# EAGLE design env_sensor_1a (EAGLE 9.7.0)
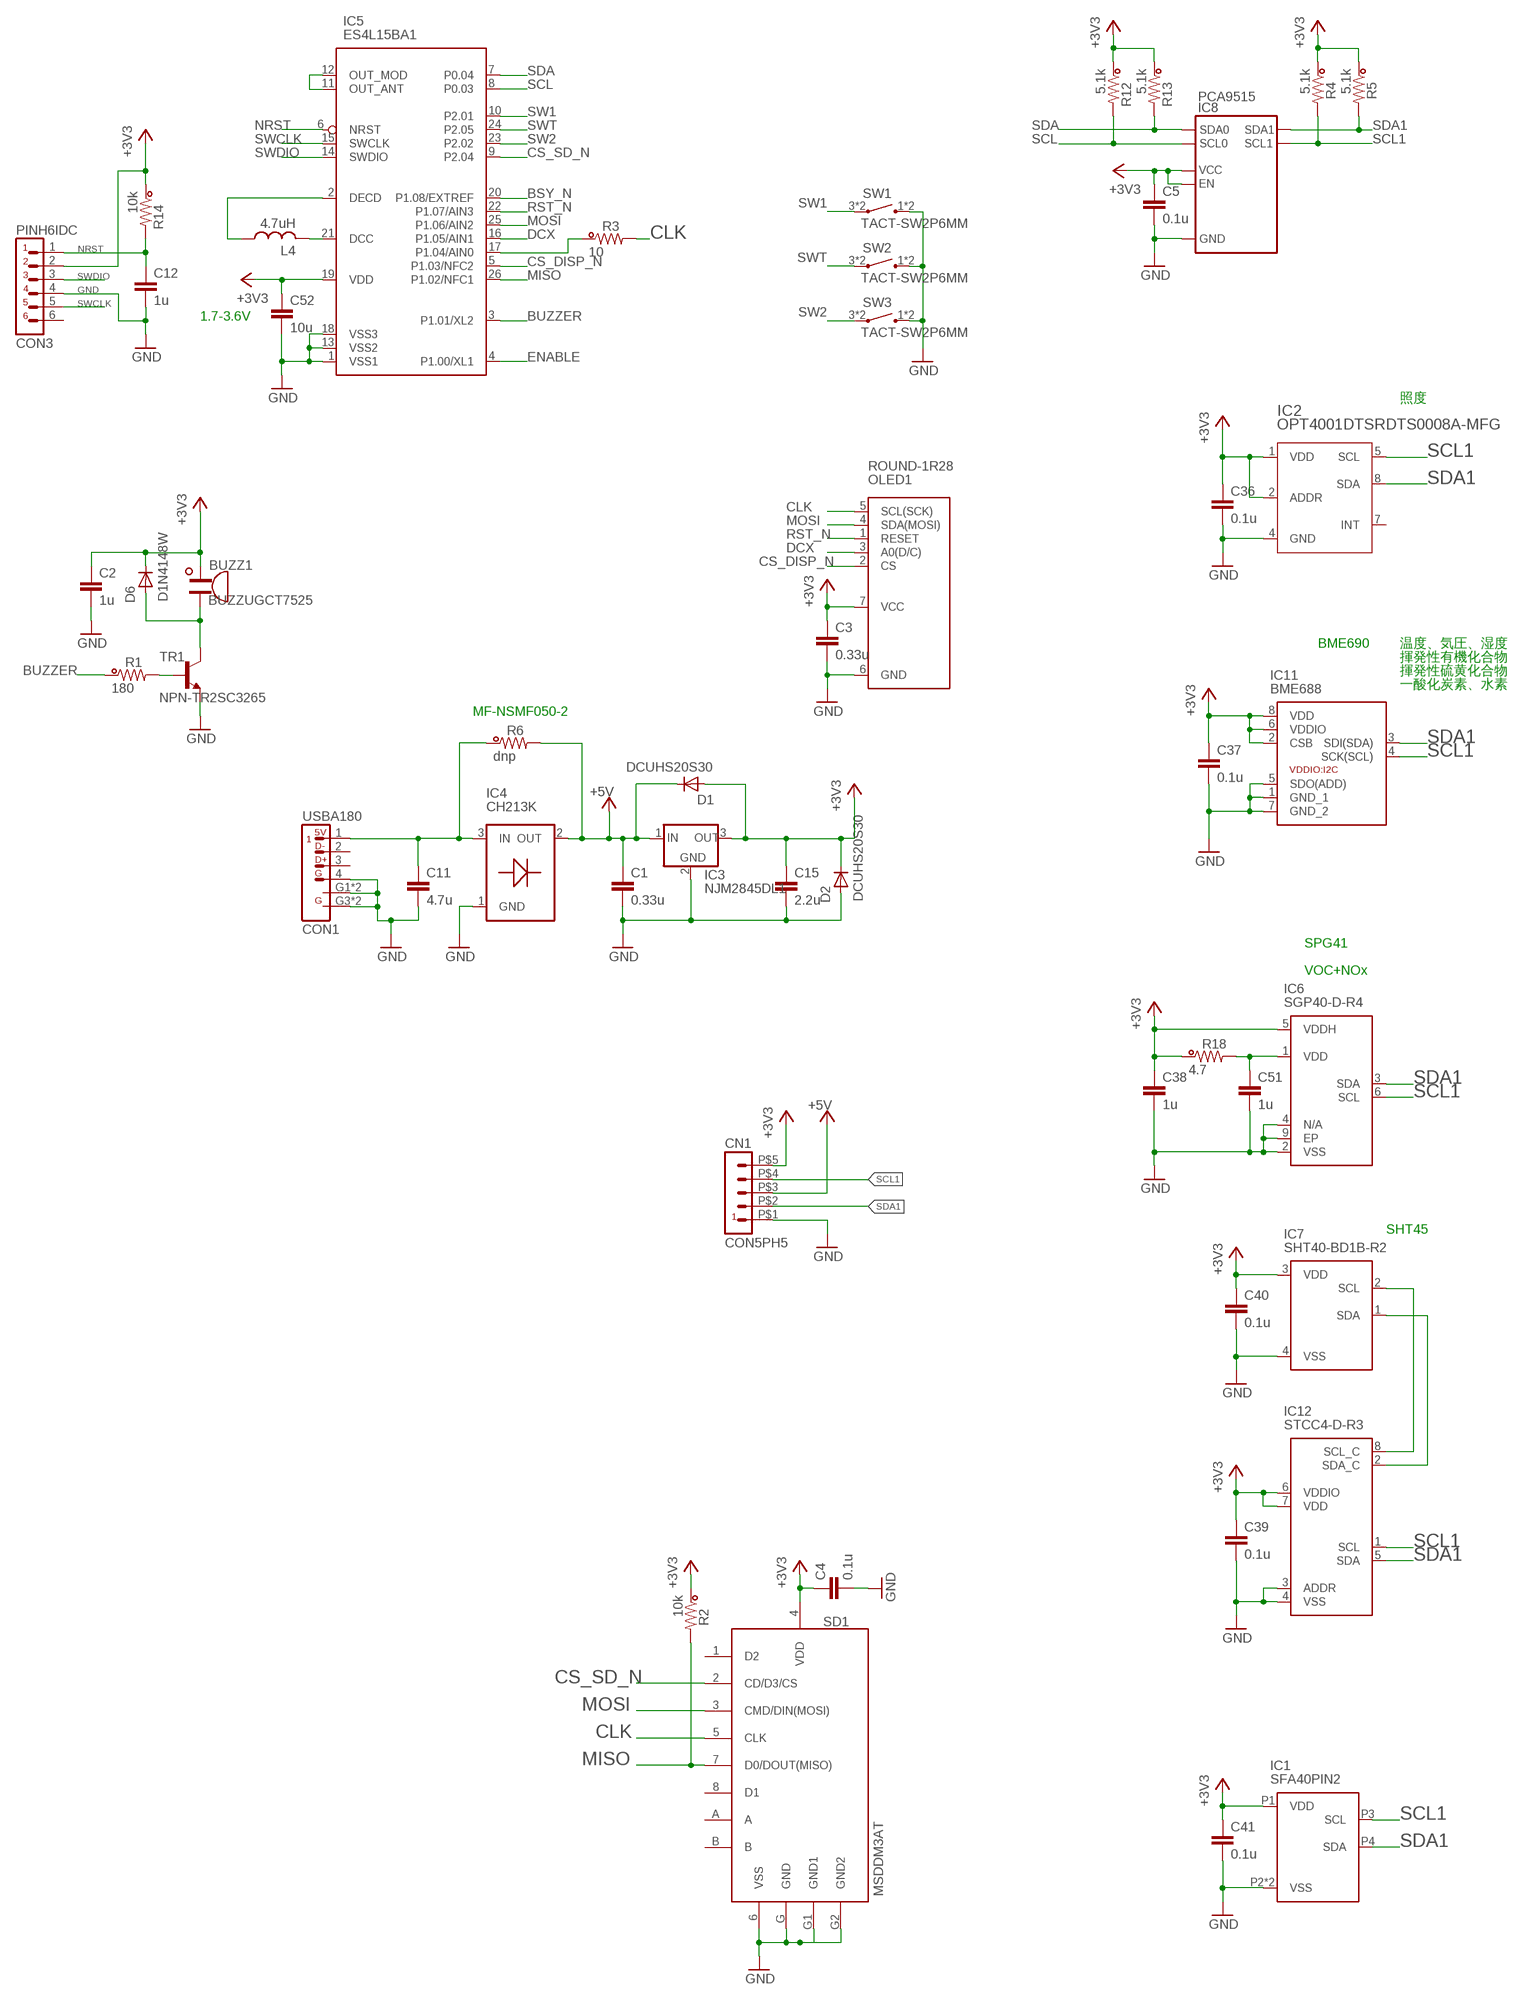
[diagram p0: schematic, sheet 1]

## Parts
BUZZ1  BUZZUGCT7525  [UGCT7525]
C1  0.33u  C-CC2015  [2015]
C2  1u  C-CC1005A  [1005A]
C3  0.33u  C-CC2015  [2015]
C4  0.1u  C-CC1005A  [1005A]
C5  0.1u  C-CC1005K  [1005K]
C11  4.7u  C-CC2015  [2015]
C12  1u  C-CC1005A  [1005A]
C15  2.2u  C-CC2015  [2015]
C36  0.1u  C-CC1005K  [1005K]
C37  0.1u  C-CC1005K  [1005K]
C38  1u  C-CC1005K  [1005K]
C39  0.1u  C-CC1005K  [1005K]
C40  0.1u  C-CC1005K  [1005K]
C41  0.1u  C-CC1005K  [1005K]
C51  1u  C-CC1005K  [1005K]
C52  10u  C-CC1608A  [1608A]
CN1  CON5PH5  [PH5]
CON1  USBA180  [USB-A-180]
CON3  PINH6IDC  [1X6IDC_1R27]
D1  DCUHS20S30  [US2H]
D2  DCUHS20S30  [US2H]
D6  D1N4148W  [1N4148W]
IC1  SFA40PIN2  [SFA40-PIN2]
IC2  OPT4001DTSRDTS0008A-MFG  [DTS0008A-MFG]
IC3  NJM2845DL1  [TO252-3]
IC4  CH213K  [SOT23-3]
IC5  ES4L15BA1  [ES4L15BA1]
IC6  SGP40-D-R4  [SON80P244X244X95-7N]
IC7  SHT40-BD1B-R2  [SHT40BD1BR2]
IC8  PCA9515  [SO8]
IC11  BME688  [BME688]
IC12  STCC4-D-R3  [STCC4DR3]
L4  4.7uH  L1608  [1608A]
OLED1  ROUND-1R28  [ROUND-1R28]
R1  180  R-CC1005A  [1005A]
R2  10k  R-CC1005A  [1005A]
R3  10  R-CC1005A  [1005A]
R4  5.1k  R-CC1005A  [1005A]
R5  5.1k  R-CC1005A  [1005A]
R6  dnp  R-CC3216  [3216]
R12  5.1k  R-CC1005A  [1005A]
R13  5.1k  R-CC1005A  [1005A]
R14  10k  R-CC1005A  [1005A]
R18  4.7  R-CC1005A  [1005A]
SD1  MSDDM3AT  [DM3AT]
SW1  TACT-SW2P6MM  [DTS-6-V]
SW2  TACT-SW2P6MM  [DTS-6-V]
SW3  TACT-SW2P6MM  [DTS-6-V]
TR1  NPN-TR2SC3265  [SOT23-3]

## Nets
+3V3: BUZZ1.P(+) C2.1 C3.1 C4.1 C5.1 C15.1 C36.1 C37.1 C38.1 C39.1 C40.1 C41.1 C52.1 CN1.P$5 CON3.2 D1.A D2.C D6.C IC1.P1(VDD) IC2.1(VDD) IC2.2(ADDR) IC3.3(OUT) IC5.19(VDD) IC6.5(VDDH) IC7.3(VDD) IC8.5(EN) IC8.8(VCC) IC11.2(CSB) IC11.6(VDDIO) IC11.8(VDD) IC12.6(VDDIO) IC12.7(VDD) OLED1.7(VCC) R2.1 R4.1 R5.1 R12.1 R13.1 R14.1 R18.1 SD1.4(VDD)
+5V: C1.1 CN1.P$3 D1.C IC3.1(IN) IC4.2(OUT) R6.2
BSY_N: IC5.20(P1.08/EXTREF)
BUZZER: IC5.3(P1.01/XL2) R1.1
CLK: OLED1.5(SCL(SCK)) R3.2 SD1.5(CLK)
CS_DISP_N: IC5.5(P1.03/NFC2) OLED1.2(CS)
CS_SD_N: IC5.9(P2.04) SD1.2(CD/D3/CS)
DCX: IC5.16(P1.05/AIN1) OLED1.3(A0(D/C))
ENABLE: IC5.4(P1.00/XL1)
GND: C1.2 C2.2 C3.2 C4.2 C5.2 C11.2 C12.2 C15.2 C36.2 C37.2 C38.2 C39.2 C40.2 C41.2 C51.2 C52.2 CN1.P$1 CON1.4 CON1.G1 CON1.G2(G1) CON1.G3(G2) CON1.G4(G2) CON3.4 D2.A IC1.P2(VSS) IC1.P6(VSS) IC2.4(GND) IC3.2(GND) IC4.1(GND) IC5.1(VSS1) IC5.13(VSS2) IC5.18(VSS3) IC6.2(VSS) IC6.4(N/A) IC6.9(EP) IC7.4(VSS) IC8.4(GND) IC11.1(GND_1) IC11.5(SDO(ADD)) IC11.7(GND_2) IC12.3(ADDR) IC12.4(VSS) OLED1.6(GND) SD1.6(VSS) SD1.G1(GND1) SD1.G2(GND2) SD1.G(GND) SW1.1(T1) SW1.2(T1) SW2.1(T1) SW2.2(T1) SW3.1(T1) SW3.2(T1) TR1.2(E)
MISO: IC5.26(P1.02/NFC1) R2.2 SD1.7(D0/DOUT(MISO))
MOSI: IC5.25(P1.06/AIN2) OLED1.4(SDA(MOSI)) SD1.3(CMD/DIN(MOSI))
N$1: IC5.17(P1.04/AIN0) R3.1
N$2: R1.2 TR1.1(B)
N$3: C11.1 CON1.1 IC4.3(IN) R6.1
N$13: BUZZ1.N(-) D6.A TR1.3(C)
N$28: C51.1 IC6.1(VDD) R18.2
N$51: IC5.21(DCC) L4.2
N$53: IC7.2(SCL) IC12.8(SCL_C)
N$55: IC7.1(SDA) IC12.2(SDA_C)
N$61: IC5.2(DECD) L4.1
N$63: IC5.11(OUT_ANT) IC5.12(OUT_MOD)
NRST: C12.1 CON3.1 IC5.6(NRST) R14.2
RST_N: IC5.22(P1.07/AIN3) OLED1.1(RESET)
SCL: IC5.8(P0.03) IC8.2(SCL0) R12.2
SCL1: CN1.P$4 IC1.P3(SCL) IC2.5(SCL) IC6.6(SCL) IC8.7(SCL1) IC11.4(SCK(SCL)) IC12.1(SCL) R4.2
SDA: IC5.7(P0.04) IC8.3(SDA0) R13.2
SDA1: CN1.P$2 IC1.P4(SDA) IC2.8(SDA) IC6.3(SDA) IC8.6(SDA1) IC11.3(SDI(SDA)) IC12.5(SDA) R5.2
SW1: IC5.10(P2.01) SW1.3(T2) SW1.4(T2)
SW2: IC5.23(P2.02) SW3.3(T2) SW3.4(T2)
SWCLK: CON3.5 IC5.15(SWCLK)
SWDIO: CON3.3 IC5.14(SWDIO)
SWT: IC5.24(P2.05) SW2.3(T2) SW2.4(T2)
Unconnected: CON1.2 CON1.3 CON3.6 IC2.7(INT) SD1.1(D2) SD1.8(D1) SD1.A SD1.B

## Notes on the sheet
- 1.7-3.6V
- 照度
- BME690 | 温度、気圧、湿度
- 揮発性有機化合物（VOC）
- 揮発性硫黄化合物（VSC）
- 一酸化炭素、水素
- MF-NSMF050-2
- SPG41
- VOC+NOx
- SHT45

## Library data of the parts
BUZZ1 = dac:BUZZ; SHOP: AKI
C1-C5 C11 C12 C15 C36-C41 C51 C52 = dac:C-CC
CN1 = dac:CON5
CON1 = dac:USBA
CON3 = dac:PINH6
D1 D2 D6 = dac:D
IC1 = SamacSys_Parts:SFA40
IC2 = SamacSys_Parts:OPT4001DTSR
IC3 = dac:NJM2845; SHOP: AKI
IC4 = dac:CH213K; SHOP: AKI
IC5 = SamacSys_Parts:ES4L15BA1: Board Mount Motion & Position Sensors 9-axis IMU Source: Datasheet <https://www.ceva-dsp.com/wp-content/uploads/2019/10/BNO080_085-Datasheet.pdf>
IC6 = SamacSys_Parts:SGP40-D-R4: Air Quality Sensors Gas Sensor 2.5k pcs IC Source: Datasheet; PARTS: SPG41
IC7 = SamacSys_Parts:SHT40-BD1B-R2: SENSIRION - SHT40-BD1B-R2 - Humidity and Temperature Sensor, Digital, 0% to 100% RH, I2C, DFN-EP-4, -40C to 125C Source: Datasheet <https://sensirion.com/media/documents/33FD6951/63E1087C/Datasheet_SHT4x_1.pdf>; PARTS: SHT4x-Axx
IC8 = dac:PCA9515
IC11 = SamacSys_Parts:BME688: Gas sensor measuring relative humidity, barometric pressure, ambient temperature and gas (VOC) Source: Datasheet <https://www.bosch-sensortec.com/media/boschsensortec/downloads/datasheets/bst-bme688-ds000.pdf>; PARTS: BME690
IC12 = SamacSys_Parts:STCC4-D-R3: Air Quality Sensors STCC4-D-R3 CO2 I2C, SMD ToR 1500 pcs 2.7V ~ 5.5V 950A 10C ~ 40C Source: Datasheet <https://sensirion.com/media/documents/6AED4B15/684A889C/CD_DS_STCC4_D1_3.pdf>
L4 = dac:L; PARTS: LSQPB160807T4R7M
OLED1 = dac:ROUND-1R28; SHOP: aliexpress
R1-R6 R12-R14 R18 = dac:R-CC
SD1 = dac:MSD
SW1-SW3 = dac:TACT-SW2P
TR1 = dac:NPN-TR; SHOP: AKI

## Board
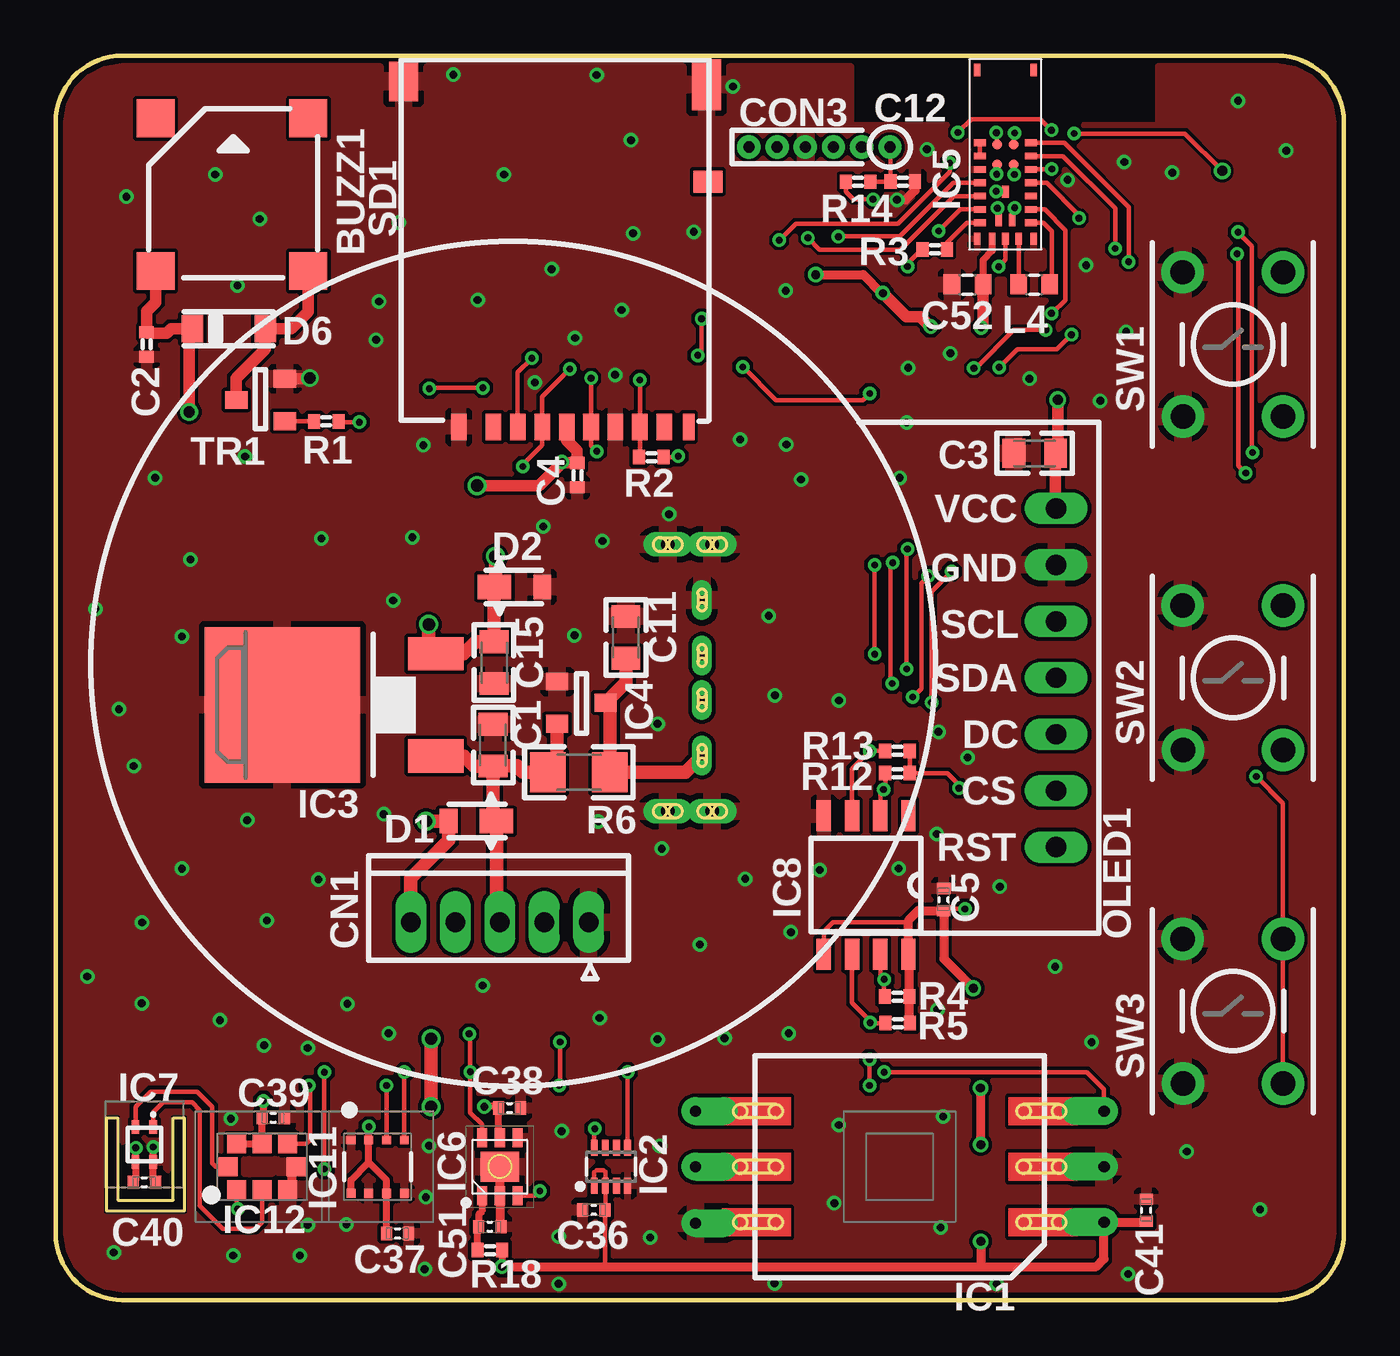
[diagram p1: board, top side]
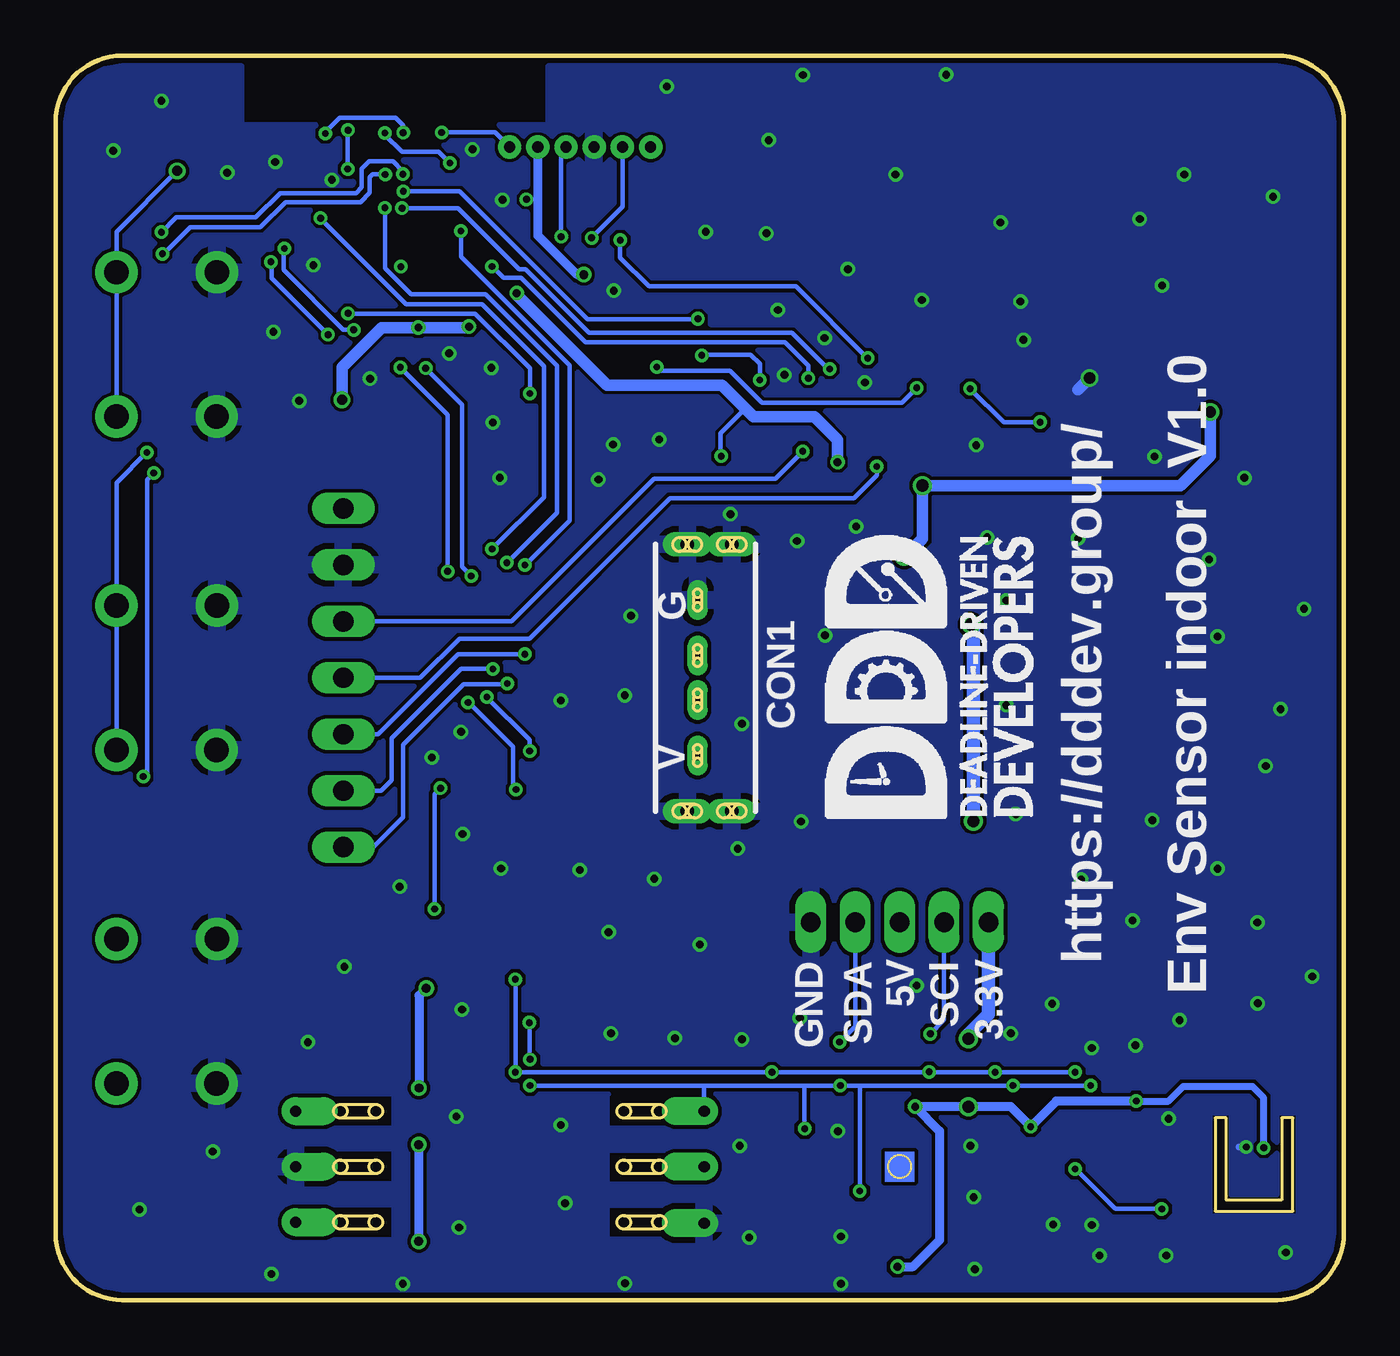
[diagram p2: board, bottom side, seen from below]

Size 58 x 56 mm. Coordinates in mm from the lower left corner, seen from the top.
Outline: 0,53 0,3 arc90 3,0 55,0 arc90 58,3 58,53 arc90 55,56 3,56 arc90 0,53
Copper layers (1*16): Top / Bottom
Stack-up Default Layer Stack: Top User Defined 0.035mm / Dielectric-1 User Defined 1.5mm / Bottom User Defined 0.035mm
Design rules: minimum drill size 12mil, copper clearance wire_polygon to wire_polygon 6mil, copper clearance wire_polygon to pad_smd 6mil, copper clearance wire_polygon to via 6mil, copper clearance pad_smd to pad_smd 6mil, copper clearance pad_smd to via 6mil, copper clearance via to via 6mil, copper clearance smd to pad (same net) 0mil, copper clearance smd to via (same net) 0mil, copper clearance smd to smd (same net) 0mil, dimension clearance 10mil, via restrict clearance 0mil, drill distance 10mil, keepout clearance 0mil
RestrictCopper: area 36,53 to 49.5,56; area 35.9,53 to 49.5,56; area 30.4,2.9 to 33,4.1; area 30.4,5.3 to 33,6.6; area 30.4,7.9 to 33,9.2; area 42.9,7.9 to 45.4,9.1; area 42.9,5.4 to 45.4,6.7; area 42.9,2.8 to 45.4,4.1; area 2.2,3.9 to 5.9,8.3; area 2.2,3.9 to 5.9,8.3; area 2.2,3.9 to 5.9,8.3; 1 lines
Milling: 8 lines

### Footprints (pad centres in the part's own frame; a part is rotated, then mirrored left to right if it is on the bottom)
UGCT7525 = smd 1.7 x 1.7: N -3.493,-3.373; P -3.493,3.493; P$3 3.373,-3.373; P$4 3.373,3.493
2015 = smd 1.016 x 1.3: 1 -0.94,0; 2 0.94,0
1005A = smd 0.55 x 0.65: 1 -0.55,0; 2 0.55,0
1005K = smd 0.5 x 0.6: 1 -0.5,0; 2 0.5,0
1608A = smd 0.75 x 0.9: 1 -0.7,0; 2 0.7,0
PH5 = drill 0.889 long: P$1 4,0; P$2 2,0; P$3 0,0; P$4 -2,0; P$5 -4,0
USB-A-180 = drill 0.4 long: 1 3.5,-0.1; 2 1,-0.1; 3 -1,-0.1; 4 -3.5,-0.1 | drill 0.6 long: G1 6,-0.56; G2 6,1.44; G3 -6,-0.56; G4 -6,1.44
1X6IDC_1R27 = drill 0.5 pad 1.05: 1 -3.81,0; 2 -2.54,0; 3 -1.27,0; 4 0,0; 5 1.27,0; 6 2.54,0
US2H = smd 0.8 x 1.1: A 0.65,0 | smd 1.5 x 1.1: C -1.504,0
1N4148W = smd 0.97 x 1.22: A 1.64,0; C -1.64,0
SFA40-PIN2 = drill 0.5 pad 1.27 offset: P1 -9.2,2.5; P2 -9.2,0; P3 -9.2,-2.5; P4 9.2,-2.5; P5 9.2,0; P6 9.2,2.54
DTS0008A-MFG = smd 0.72 x 0.3: 1 -0.86,0.75; 2 -0.86,0.25; 3 -0.86,-0.25; 4 -0.86,-0.75; 5 0.86,-0.75; 6 0.86,-0.25; 7 0.86,0.25; 8 0.86,0.75
TO252-3 = smd 1.5 x 2.5: 1 -2.3,-3.45; 3 2.3,-3.45 | smd 7 x 7: 2 0,3.45
SOT23-3 = smd 0.8 x 1: 1 -0.95,-1.1; 2 0.95,-1.1; 3 0,1.08
ES4L15BA1 = smd 0.55 x 0.3: 1 -3.8,-1.275; 18 -3.8,1.275; 19 -3.8,0.6; 20 -3.8,0; 21 -3.8,-0.6; 22 -2.95,-0.3; 25 -2.95,0.3; 26 -1.675,0; 27 3.8,-1.275; 28 3.8,1.275 | smd 0.3 x 0.55: 2 -3.075,-1.15; 3 -2.475,-1.15; 4 -1.875,-1.15; 5 -1.275,-1.15; 6 -0.675,-1.15; 7 -0.075,-1.15; 8 0.525,-1.15; 11 0.525,1.15; 12 -0.075,1.15; 13 -0.675,1.15; 14 -1.275,1.15; 15 -1.875,1.15; 16 -2.475,1.15; 17 -3.075,1.15 | smd 0.45 x 0.45: 9 0.45,-0.375; 10 0.45,0.375; 23 -0.45,-0.375; 24 -0.45,0.375
SON80P244X244X95-7N = smd 0.85 x 0.45: 1 -1.3,0.8; 2 -1.3,0; 3 -1.3,-0.8; 4 1.3,-0.8; 5 1.3,0; 6 1.3,0.8 | smd 1.35 x 1.73: 9 0,0
SHT40BD1BR2 = smd 0.62 x 0.35: 1 -0.79,0.4; 2 -0.79,-0.4; 3 0.79,-0.4; 4 0.79,0.4
SO8 = smd 0.65 x 1.4: 1 -1.905,-3.115; 2 -0.635,-3.115; 3 0.635,-3.115; 4 1.905,-3.115; 5 1.905,3.115; 6 0.635,3.115; 7 -0.635,3.115; 8 -1.905,3.115
BME688 = smd 0.4 x 0.4: 1 1.2,1.2; 2 1.2,0.4; 3 1.2,-0.4; 4 1.2,-1.2; 5 -1.2,-1.2; 6 -1.2,-0.4; 7 -1.2,0.4; 8 -1.2,1.2
STCC4DR3 = smd 0.85 x 0.85: 1 -1.025,1.15; 2 -1.025,0; 3 -1.025,-1.15; 4 0,-1.525; 5 1.025,-1.15; 6 1.025,0; 7 1.025,1.15; 8 0,1.525
ROUND-1R28 = drill 0.915 long: 1 -19.05,7.62; 2 -19.05,5.08; 3 -19.05,2.54; 4 -19.05,0; 5 -19.05,-2.54; 6 -19.05,-5.08; 7 -19.05,-7.62
3216 = smd 1.6 x 1.8: 1 -1.397,0; 2 1.397,0
DM3AT = smd 1.2 x 0.7: 1 -5.046,7.7; 2 -5.046,6.6; 3 -5.046,5.5; 4 -5.046,4.4; 5 -5.046,3.3; 6 -5.046,2.2; 7 -5.046,1.1; 8 -5.046,0; G -5.046,9.25 | smd 1.2 x 0.5: A -5.046,-1.1 | smd 1 x 1.3: B 6,-1.96 | smd 1.778 x 1.3: G1 10.507,11.737 | smd 2.286 x 1.3: G2 10.358,-1.893
DTS-6-V = drill 1.1 pad 1.905: 1 -3.25,2.25; 2 3.25,2.265; 3 -3.25,-2.25; 4 3.25,-2.25

### Placement (x,y rotation side)
BUZZ1  8,49.8 90 top
C1  19.7,24.97 90 top
C2  4.1,43 270 top
C3  44.08,38.1 180 top
C4  23.49,37.12 270 top
C5  39.98,18.02 90 top
C11  25.67,29.82 90 top
C12  38.14,50.33 0 top
C15  19.74,28.68 270 top
C36  24.23,4.05 180 top
C37  15.4,3 0 top
C38  20.44,8.64 0 top
C39  9.8,8.2 0 top
C40  4,5.3 0 top
C41  49.1,4.04 90 top
C51  19.55,3.3 0 top
C52  41.05,45.7 180 top
CN1  20,17 0 top
CON1  29,28 270 bottom
CON3  33.75,51.88 180 top
D1  18.34,21.55 180 top
D2  21.26,32.09 0 top
D6  7.8,43.7 0 top
IC1  38,6 180 top
IC2  25,6 90 top
IC3  13.66,26.78 90 top
IC4  23.68,26.88 270 top
IC5  42.76,51.55 90 top
IC6  20,6 90 top
IC7  4,7 270 top
IC8  36.49,18.67 180 top
IC11  14.5,6 90 top
IC12  9.3,6 90 top
L4  44.05,45.7 180 top
OLED1  26,28 180 top
R1  12.19,39.54 180 top
R2  26.82,37.93 180 top
R3  39.58,47.28 180 top
R4  37.89,13.65 180 top
R5  37.91,12.46 180 top
R6  23.56,23.75 180 top
R12  37.9,23.71 180 top
R13  37.9,24.71 180 top
R14  36.13,50.32 0 top
R18  19.55,2.25 180 top
SD1  27.41,44.33 90 top
SW1  53,43 90 top
SW2  53,28 90 top
SW3  53,13 90 top
TR1  9.22,40.5 90 top

### Tracks (layer width: path | path; a pad name or v marks a point on that pad's centre or on a via)
+3V3  (via drill 0.3, 0.35, 0.4, 0.45, 0.5, 0.55)
  Top 0.2: IC2.1 24.25,5.75 24.35,5.85 24.67,5.85 24.75,5.77 IC2.2 24.75,4.07 C36.1 24.73,1.52 24.75,1.5 | R2.1 27.99,37.93 v28.03,37.97 | R13.1 R12.1 40.15,23.71 40.67,23.19 v40.67,23.03 | v40.94,17.6 40.06,17.6 C5.1 | IC8.5 34.59,16.59 35,17 38.31,17 38.39,17.09 | R14.1 35.58,49.87 35.92,49.53 v36.8,49.53
  Top 0.305: IC5.19 42.16,47.21 41.75,46.8 C52.1 | C37.1 IC11.6 14.9,5.4 14.1,6.2 | 14.1,6.2 IC11.2 v14.1,7.8 | IC11.8 13.3,5.4 14.1,6.2 | IC6.5 19.94,7.36 C38.1 | C40.1 3.6,5.4 IC7.3 v3.6,6.84 v3.61,6.85 | v9.35,8.95 9.35,8.25 C39.1 IC12.6 IC12.7 | v19.3,8.7 19.34,8.74 19.84,8.74 | R18.1 v20.1,1.5
  Top 0.406: v20.1,1.5 24.75,1.5 41.55,1.5 | 41.55,1.5 46.85,1.5 47.2,1.85 IC1.P1 49.06,3.5 C41.1 | R5.1 38.44,12.48 R4.1 38.44,15.51 IC8.8 38.39,17.09 38.83,17.52 C5.1 39.98,15.36 v41.31,14.03 | v41.64,9.54 v41.64,7 v41.65,6.99 | v41.65,2.64 41.65,1.6 41.55,1.5 | v34.22,46.14 36.36,46.14 37.19,45.31 v37.24,45.31
  Top 0.508: BUZZ1.P 4.51,44.91 4.1,44.5 C2.1 4.15,43.5 5,43.5 5.2,43.7 D6.C | v41.67,43.76 41.75,43.84 C52.1 | 22.99,39.3 SD1.4 23.01,38.69 23.48,38.22 C4.1 23.21,37.67 22.82,37.68 | 22.82,37.68 v22.8,37.7 | v6.02,39.96 6.02,43.56 | v39.39,43.8 38.94,44.25 38.3,44.25 v37.24,45.31 | v45.11,40.51 45.11,38.19 C3.1 45.02,35.65 OLED1.7 | v18.98,36.65 21.76,36.65 22.79,37.68 22.82,37.68
  Top 0.61: v16.91,11.76 v16.91,8.7 | CN1.P$5 15.99,18.98 17.69,20.68 D1.A v16.68,21.55 | v19.8,33.46 19.8,32.13 D2.C 19.74,32.07 C15.1 18.91,29.62 18.37,29.08 IC3.3 16.8,29.39 v16.8,30.4
  Bottom 0.2: v28.03,37.97 28.07,38.01 28.07,39 27.05,40.02 27.05,40.22 | v40.67,23.03 40.94,22.76 v40.94,17.6 | v36.8,49.53 36.3,49.53 36.29,49.54
  Bottom 0.305: v9.35,8.95 7.9,8.95 7.25,9.6 4.11,9.6 3.61,9.1 v3.61,6.85
  Bottom 0.406: v9.35,8.95 12.95,8.95 v14.1,7.8 15,8.7 v16.91,8.7 v19.3,8.7 18.2,7.6 18.2,2.7 19.4,1.5 v20.1,1.5 | 16.91,11.96 v16.91,11.76 | v41.31,14.03 41.64,13.7 v41.64,9.54 | v41.65,6.99 v41.65,2.64 | CON3.2 36.29,49.54 36.29,47.91 34.52,46.14 v34.22,46.14
  Bottom 0.508: v39.39,43.8 39.43,43.76 v41.67,43.76 43.32,43.76 45.11,41.97 v45.11,40.51 | v22.8,37.7 22.8,38.71 23.83,39.74 26.58,39.74 27.05,40.22 28.01,41.17 33.17,41.17 37.24,45.24 v37.24,45.31 | v6.02,39.96 6.02,38 7.37,36.65 v18.98,36.65 18.98,34.25 19.77,33.46 v19.8,33.46
  Bottom 0.61: CN1.P$5 16,12.87 16.91,11.96 | v16.68,21.55 16.68,30.28 v16.8,30.4
+5V
  Top 0.61: C1.1 20.77,24.03 21.05,23.75 R6.2 22.19,23.72 22.58,24.11 IC4.2 | C1.1 19.7,21.69 D1.C 19.84,17.16 CN1.P$3 | IC3.1 18.38,24.48 18.85,24.01 19.68,24.01 C1.1
BSY_N  (via drill 0.3)
  Top 0.2: IC5.20 42.76,46.81 v42.45,46.5
BUZZER  (via drill 0.3)
  Top 0.2: IC5.3 44.53,49.08 45.46,48.15 45.46,45 44.86,44.4 v44.83,44.4 | R1.1 12.78,39.5 v13.68,39.5 | v19.23,41.05 16.87,41.05 v16.83,41.01 | v36.65,40.79 36.35,40.49 32.44,40.49 v30.94,41.99
  Bottom 0.2: v16.83,41.01 15.32,39.5 v13.68,39.5 | v19.23,41.05 19.91,40.37 26.2,40.37 27.65,41.82 30.77,41.82 v30.94,41.99 | v44.83,44.4 44.81,44.38 39.11,44.38 36.65,41.92 v36.65,40.79
CLK  (via drill 0.3)
  Top 0.2: R3.2 39.01,47.28 38.35,46.62 v38.35,46.51 | SD1.5 24.34,39.51 | SD1.5 v24.11,41.48 | SD1.5 24.11,38.44 v24.36,38.19
  Bottom 0.2: v38.35,46.51 37.84,46 37.04,46 34.15,43.11 25.17,43.11 24.11,42.05 v24.11,41.48 | v24.36,38.19 25.6,36.95 31.06,36.95 37.47,30.54 OLED1.5
CS_DISP_N  (via drill 0.3)
  Top 0.2: IC5.5 44.62,50.27 46.07,48.82 v46.07,48.68 | v38.35,33.8 38.31,33.76 v38.31,28.39
  Bottom 0.2: v46.07,48.68 46.07,48.65 42.22,44.8 38.81,44.8 36.02,42.01 36.02,36.13 v38.35,33.8 | OLED1.2 43.34,22.92 42.87,23.39 42.87,25.29 39.75,28.41 38.31,28.41 v38.31,28.39
CS_SD_N  (via drill 0.3, 0.3 pad 0.4)
  Top 0.2: IC5.9 43.13,52.38 43.22,52.47 v43.18,52.51 | v40.25,51.16 40.25,50.77 37.92,48.44 33.33,48.44 v32.58,47.69 | v21.44,42.38 20.81,41.75 SD1.2
  Bottom 0.2: v43.18,52.51 43.18,52.44 42.41,51.67 40.76,51.67 v40.25,51.16 | v21.44,42.38 v21.45,42.38 24.68,45.61 31.29,45.61 32.58,46.9 v32.58,47.69
DCX  (via drill 0.3)
  Top 0.2: IC5.16 40.73,49.08 v39.75,48.1 | v36.87,29.06 v36.87,33.07
  Bottom 0.2: v39.75,48.1 39.75,46.95 34.87,42.07 34.87,35.07 v36.87,33.07 | OLED1.3 43.48,25.46 39.88,29.06 v36.87,29.06
GND  (via drill 0.3, 0.35, 0.5)
  Top 0.305: v37.88,49.51 38.27,49.51 | v4.4,6.88 IC7.4 4.4,5.4 C40.2
  Top 0.406: IC12.4 10.62,5.8 10.62,5.14 IC12.3 | IC6.9 IC6.2 20,3.35 C51.2 | 38.27,49.51 38.69,49.94 C12.2
  Top 0.508: TR1.2 11.41,41.45 v11.45,41.49
  Bottom 0.305: v4.4,6.88 4.71,6.88 4.72,6.89
  Bottom 0.508: v11.45,41.49 11.97,40.97
  other vias: 19,45 25.9,52.19 26,48 30.82,38.72 11.83,18.92 8,2 11,2 9.51,17.08 24.49,12.69 29,16 33,12 15,12 45,15 38,37 39.84,3.26 54.22,4.07 46.64,11.6 19.23,14.15 50.92,6.68 14.56,44.93 4.48,37 5.69,19.41 20.19,50.65 24.62,34.16 55.4,51.72 30.49,54.61 28.73,48.07 50.27,50.73 27.29,20.31 48.19,43.57 14.43,43.21 16.56,38.47 15.46,48.49 22.33,46.39 9.39,11.46 13.14,13.33 47.03,40.46 27.1,11.73 30.12,11.78 32.38,27.21 31.05,18.95 33.56,36.92 22.65,2.86 33.1,16.55 16.81,6.94 16.67,4.63 11.35,11.34 17.91,55.14 24.36,55.12 1.8,31.1 3.52,24.03 39.23,51.78 9.19,48.65 3.19,49.65 7.19,50.65 8.19,45.65 8.53,37.96 25.19,41.63 25.48,44.55 32.87,45.42 21.57,41.29 23.38,43.29 32.1,30.79 27.62,35.36 23.36,29.91 35.26,26.98 32.9,38.5 39.75,25.57 41.06,24.41 37.95,19.42 39.67,20.97 42.51,18.6 34.4,19.35 39.7,13.07 39.96,8.26 35.26,7.88 35.06,4.36 48.28,1.17 26.77,2.81 22.78,7.6 27.2,6.94 22.65,0.73 32.37,0.75 42.37,0.73 16.62,1.39 13.09,3.4 11.35,3.38 7.4,12.59 1.43,14.56 3.88,13.35 3.9,16.99 14.77,21.86 8.63,21.59 24.44,21.53 16.06,34.32 15.2,31.48 11.97,34.27 6.07,33.32 15.21,26.77 2.86,26.59 5.69,29.86 46.39,46.57 45.56,50.41 48.11,51.21 53.23,53.96 43.84,41.46 40.28,42.6 38.38,41.95 38.31,39.49 2.62,2.14 7.9,8.16 27.1,25.93 21.96,34.81
  pour Top: -0.3,56 59,56 59,-0.4 -0.3,-0.4
  pour Bottom: 59,56 -0.1,56 -0.1,-0.2 59,-0.2
MISO  (via drill 0.3, 0.3 pad 0.4)
  Top 0.2: IC5.26 42.36,49.88 v42.34,49.89 | v26.3,41.4 SD1.7 26.31,38.07 R2.2 | v29.08,44.16 29.08,42.68 v28.91,42.51
  Bottom 0.2: v42.34,49.89 39.8,49.89 34.05,44.14 29.1,44.14 v29.08,44.16 | v28.91,42.51 28.88,42.54 26.71,42.54 26.3,42.13 v26.3,41.4
MOSI  (via drill 0.3, 0.3 pad 0.4)
  Top 0.2: IC5.25 42.46,49.07 v42.4,49.13 | v23.15,41.9 21.91,40.66 SD1.3 21.91,38.46 21.03,37.58 v21.03,37.51
  Top 0.254: IC5.25
  Bottom 0.2: v42.4,49.13 39.87,49.13 37.12,46.39 36.84,46.39 33.98,43.53 24.85,43.53 23.22,41.9 v23.15,41.9 | OLED1.4 41.58,28 39.82,29.76 36.66,29.76 30.35,36.07 22.07,36.07 21.03,37.11 v21.03,37.51
N$1
  Top 0.2: R3.1 40.13,47.58 41.02,48.48 IC5.17
N$2
  Top 0.2: R1.2 TR1.1
N$3
  Top 0.61: CON1.1 28.35,23.75 R6.1 24.96,26.68 IC4.3 25.67,27.79 C11.1
N$13
  Top 0.508: BUZZ1.N 11.37,44.47 10.6,43.7 D6.A 9.44,42.78 8.14,41.48 TR1.3
N$28
  Top 0.305: R18.2 19,3.25 C51.1 19.05,3.85 19.2,4 IC6.1
N$51
  Top 0.2: IC5.21 L4.2
N$53
  Top 0.2: IC7.2 3.6,8.7 4.28,9.38 6.38,9.38 7.06,8.7 7.06,6.15 7.21,6 IC12.8
N$55
  Top 0.2: IC12.2 9.3,3.5 9,3.2 7.53,3.2 6.49,4.24 6.49,8.55 6.15,8.89 4.85,8.89 4.4,8.44 IC7.1
N$61
  Top 0.2: IC5.2 44.48,48.48 44.85,48.1 44.85,45.8 L4.1
N$63
  Top 0.2: IC5.12 IC5.11
NRST  (via drill 0.3)
  Top 0.2: IC5.6 44.83,50.88 v44.85,50.9 | v44.83,52.64 44.33,53.14 41.22,53.14 v40.62,52.54 | R14.2 C12.1 | C12.1 | CON3.1 37.59,51.86 C12.1
  Bottom 0.2: v44.85,50.9 44.85,52.62 v44.83,52.64 | v40.62,52.54 38.22,52.54 CON3.1
RST_N  (via drill 0.3, 0.3 pad 0.4)
  Top 0.2: IC5.22 43.06,49.04 | v37.66,27.74 37.58,27.82 37.58,33.08 v37.68,33.18
  Top 0.254: 43.06,49.04 v43.17,49.15
  Bottom 0.2: v43.17,49.15 43.17,46.43 41.99,45.25 38.64,45.25 35.43,42.04 35.43,35.43 v37.68,33.18 | OLED1.1 43.71,20.38 42.36,21.73 42.36,24.99 39.63,27.72 37.68,27.72 v37.66,27.74
SCL  (via drill 0.3)
  Top 0.2: IC5.8 45.41,52.08 48.31,49.17 v48.31,46.72 | IC8.2 37.12,22.82 v37.27,22.97 37.35,23.05 R12.2 | v39.43,26.89 39.43,31.87 v40.35,32.79 | v42.48,41.97 43.29,42.78 45.07,42.78 v45.73,43.44
  Bottom 0.2: v37.27,22.97 37.4,23.1 37.4,24.89 39.4,26.89 v39.43,26.89 | v40.35,32.79 40.35,39.84 v42.48,41.97 | v45.73,43.44 48.28,45.99 48.28,46.72 v48.31,46.72
SCL1  (via drill 0.3)
  Top 0.2: v8.2,4.1 8.15,4.15 IC12.1 | v37.3,10.25 46.43,10.25 47.2,9.48 IC1.P3 | v12.1,10.25 v12.1,5.9 | v15.7,10.25 IC11.4 | IC6.6 19.2,7.9 18.67,8.43 v18.67,10.27 18.67,11.93 v18.62,11.98 | IC2.5 v25.75,10.25 | IC8.7 37.12,14.61 v37.3,14.43 37.3,13.69 R4.2
  Bottom 0.2: v12.1,10.25 v15.7,10.25 18.65,10.25 v18.67,10.27 18.69,10.25 v25.75,10.25 v37.3,10.25 v37.3,14.43 | v8.2,4.1 10.3,4.1 v12.1,5.9 | CN1.P$4 18,12.6 v18.62,11.98
SDA  (via drill 0.3)
  Top 0.2: IC5.7 45.36,51.48 47.7,49.13 v47.7,47.32 | v44.58,43.66 43.15,43.66 41.42,41.93 v41.34,41.93 | v39.29,32.58 38.97,32.26 38.97,27.51 v38.59,27.13 | R13.2 v36.66,24.71 35.86,23.91 IC8.3
  Bottom 0.2: v47.7,47.32 47.74,47.28 47.74,46.35 45.05,43.66 v44.58,43.66 | v41.34,41.93 39.7,40.29 39.7,32.99 v39.29,32.58 | v38.59,27.13 36.66,25.2 v36.66,24.71
SDA1  (via drill 0.3)
  Top 0.2: v21.8,4.9 21.6,4.7 IC6.3 | v11.4,9.65 11.45,9.6 11.45,7.2 11.27,7.02 IC12.5 | v14.9,9.65 IC11.3 | IC2.8 24.25,7.68 v24.28,7.71 | v22.71,11.61 22.71,9.69 v22.67,9.65 | IC8.6 35.86,13.38 36.71,12.52 | 36.71,12.52 v36.67,12.48 | v36.64,10.83 v36.64,9.65 | R5.2 36.77,12.46 36.71,12.52
  Bottom 0.2: v11.4,9.65 v14.9,9.65 21.8,9.65 | 21.8,9.65 v22.67,9.65 24.24,9.65 | 24.24,9.65 28.77,9.65 | 28.77,9.65 v36.64,9.65 | v24.28,7.71 24.28,9.61 24.24,9.65 | v21.8,4.9 21.8,9.65 | CN1.P$2 22,12.32 v22.71,11.61 | v36.67,12.48 36.67,10.86 v36.64,10.83 | IC1.P4 28.8,9.62 28.77,9.65
SW1  (via drill 0.3, 0.3 pad 0.4, 0.45)
  Top 0.2: IC5.10 42.38,52.5 v42.35,52.53 | v45.85,52.49 50.84,52.49 v52.52,50.81
  Bottom 0.2: v42.35,52.53 42.35,52.86 42.69,53.2 45.22,53.2 45.85,52.57 v45.85,52.49 | SW1.3 SW1.4 55.25,48.08 v52.52,50.81
SW2  (via drill 0.3, 0.3 pad 0.4)
  Top 0.2: IC5.23 43.13,50.65 v43.16,50.65 | v53.19,47.08 53.25,47.02 53.25,37.55 v53.58,37.22 | v54.05,23.56 55.25,22.36 SW3.4 SW3.3
  Bottom 0.2: v43.16,50.65 43.72,50.65 43.85,50.52 43.85,49.83 44.27,49.41 47.65,49.41 48.79,48.27 51.93,48.27 53.12,47.08 v53.19,47.08 | v53.58,37.22 53.88,36.92 53.88,23.73 v54.05,23.56
SWCLK  (via drill 0.3)
  Top 0.2: IC5.15 40.44,49.67 38.03,47.27 34.4,47.27 v33.87,47.8
  Bottom 0.2: CON3.5 32.48,49.19 v33.87,47.8
SWDIO  (via drill 0.3)
  Top 0.2: IC5.14 40.41,50.27 38.02,47.88 35.27,47.88 v35.24,47.85
  Bottom 0.2: CON3.3 35.24,51.66 v35.24,47.85
SWT  (via drill 0.3, 0.3 pad 0.4)
  Top 0.2: IC5.24 42.37,51.09 v42.37,50.66 | v53.23,48.05 53.85,47.43 53.85,38.18 v53.89,38.14
  Bottom 0.2: SW2.3 SW2.4 55.25,36.78 v53.89,38.14 | v42.37,50.66 42.37,50.8 42.81,51.24 43.88,51.24 44.22,50.9 44.22,50.07 44.48,49.81 47.89,49.81 48.98,48.72 52.56,48.72 v53.23,48.05

### Text on the board
bPlace: https://dddev.group/ | 3.3V | SCl | 5V | SDA | GND | Env Sensor indoor V1.0